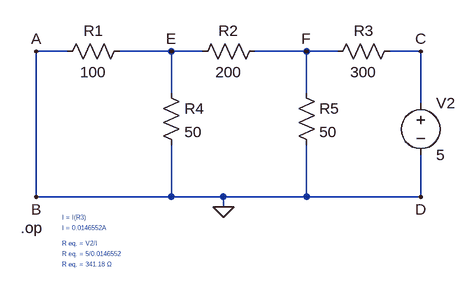
[diagram p0: schematic Eq_R_part2.asc]
Eq_R_part2.asc, the LTspice schematic file:
Version 4
SHEET 1 880 680
WIRE 96 32 48 32
WIRE 256 32 176 32
WIRE 304 32 256 32
WIRE 464 32 384 32
WIRE 512 32 464 32
WIRE 640 32 592 32
WIRE 256 96 256 32
WIRE 464 96 464 32
WIRE 640 112 640 32
WIRE 48 256 48 32
WIRE 256 256 256 176
WIRE 256 256 48 256
WIRE 336 256 256 256
WIRE 464 256 464 176
WIRE 464 256 336 256
WIRE 640 256 640 192
WIRE 640 256 464 256
WIRE 336 272 336 256
FLAG 336 272 0
FLAG 48 32 A
FLAG 48 256 B
FLAG 640 32 C
FLAG 640 256 D
FLAG 256 32 E
FLAG 464 32 F
SYMBOL voltage 640 96 R0
SYMATTR InstName V2
SYMATTR Value 5
SYMBOL res 192 16 R90
WINDOW 0 0 56 VBottom 2
WINDOW 3 32 56 VTop 2
SYMATTR InstName R1
SYMATTR Value 100
SYMBOL res 400 16 R90
WINDOW 0 0 56 VBottom 2
WINDOW 3 32 56 VTop 2
SYMATTR InstName R2
SYMATTR Value 200
SYMBOL res 608 16 R90
WINDOW 0 0 56 VBottom 2
WINDOW 3 32 56 VTop 2
SYMATTR InstName R3
SYMATTR Value 300
SYMBOL res 240 80 R0
SYMATTR InstName R4
SYMATTR Value 50
SYMBOL res 448 80 R0
SYMATTR InstName R5
SYMATTR Value 50
TEXT 24 304 Left 2 !.op
TEXT 88 288 Left 0 ;I = I(R3)
TEXT 88 304 Left 0 ;I = 0.0146552A
TEXT 88 328 Left 0 ;R eq. = V2/I
TEXT 88 344 Left 0 ;R eq. = 5/0.0146552
TEXT 88 360 Left 0 ;R eq. = 341.18 Ω

The netlist it stands for:
* Eq_R_part2.asc
V2 C 0 5
R1 E 0 100
R2 F E 200
R3 C F 300
R4 E 0 50
R5 F 0 50
.op
* I = I(R3)
* I = 0.0146552A
* R eq. = V2/I
* R eq. = 5/0.0146552
* R eq. = 341.18 Ω
.backanno
.end

* Results of the author's LTspice run, read from the files saved beside the schematic
* Operating Point:
*   V(c) = 5 V
*   V(e) = 86.21 mV
*   V(f) = 603.4 mV
*   I(R5) = 12.07 mA
*   I(R4) = 1.724 mA
*   I(R3) = 14.66 mA
*   I(R2) = 2.586 mA
*   I(R1) = 862.1 µA
*   I(V2) = -14.66 mA